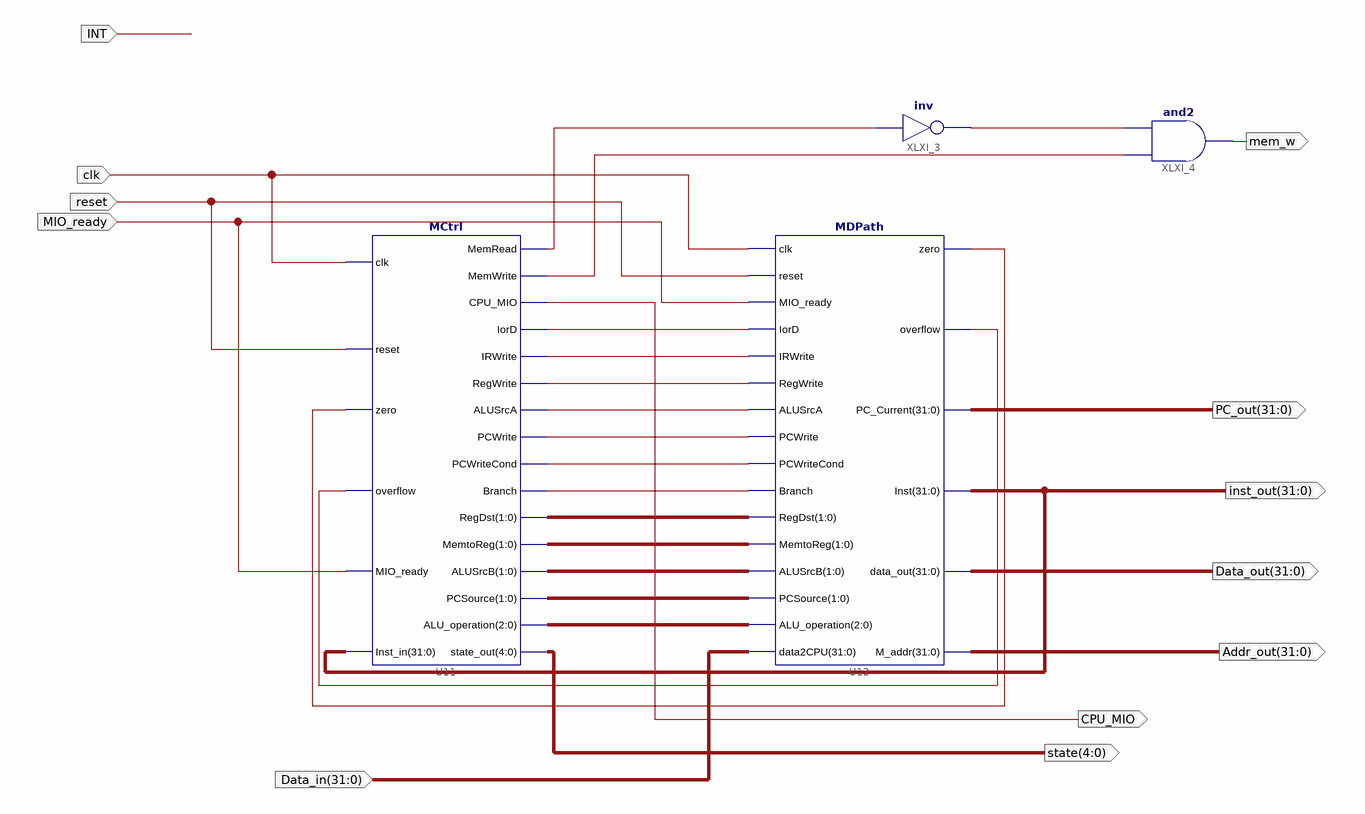
[diagram p0: schematic sheet 1]
// Xilinx ISE schematic Multi_CPU.sch (kintex7) as structural Verilog: 4 symbols, 12 ports
module Multi_CPU (
  input  [31:0] Data_in,
  input  clk,
  input  reset,
  input  MIO_ready,
  input  INT,
  output CPU_MIO,
  output [4:0] state,
  output mem_w,
  output [31:0] inst_out,
  output [31:0] PC_out,
  output [31:0] Data_out,
  output [31:0] Addr_out
);

  wire XLXN_1, XLXN_2, XLXN_3, XLXN_4, XLXN_5, XLXN_6, XLXN_7, XLXN_26, XLXN_27, XLXN_31, XLXN_32, XLXN_39;
  wire [1:0] XLXN_8, XLXN_9, XLXN_10, XLXN_11;
  wire [2:0] XLXN_12;

  MCtrl U11 (
    .zero(XLXN_26), .overflow(XLXN_27), .MIO_ready(MIO_ready), .Inst_in(inst_out), .MemRead(XLXN_31),
    .MemWrite(XLXN_32), .CPU_MIO(CPU_MIO), .IorD(XLXN_1), .IRWrite(XLXN_2), .RegWrite(XLXN_3),
    .ALUSrcA(XLXN_4), .PCWrite(XLXN_7), .PCWriteCond(XLXN_6), .Branch(XLXN_5), .RegDst(XLXN_8),
    .MemtoReg(XLXN_9), .ALUSrcB(XLXN_10), .PCSource(XLXN_11), .ALU_operation(XLXN_12), .state_out(state),
    .reset(reset), .clk(clk));
  MDPath U12 (
    .clk(clk), .reset(reset), .MIO_ready(MIO_ready), .IorD(XLXN_1), .IRWrite(XLXN_2), .RegWrite(XLXN_3),
    .ALUSrcA(XLXN_4), .PCWrite(XLXN_7), .PCWriteCond(XLXN_6), .Branch(XLXN_5), .RegDst(XLXN_8),
    .MemtoReg(XLXN_9), .ALUSrcB(XLXN_10), .PCSource(XLXN_11), .ALU_operation(XLXN_12), .data2CPU(Data_in),
    .zero(XLXN_26), .overflow(XLXN_27), .PC_Current(PC_out), .Inst(inst_out), .data_out(Data_out),
    .M_addr(Addr_out));
  not XLXI_3 (XLXN_39, XLXN_31);
  and XLXI_4 (mem_w, XLXN_32, XLXN_39);
endmodule
